# EAGLE design rgbRadioLight (EAGLE 5.09)
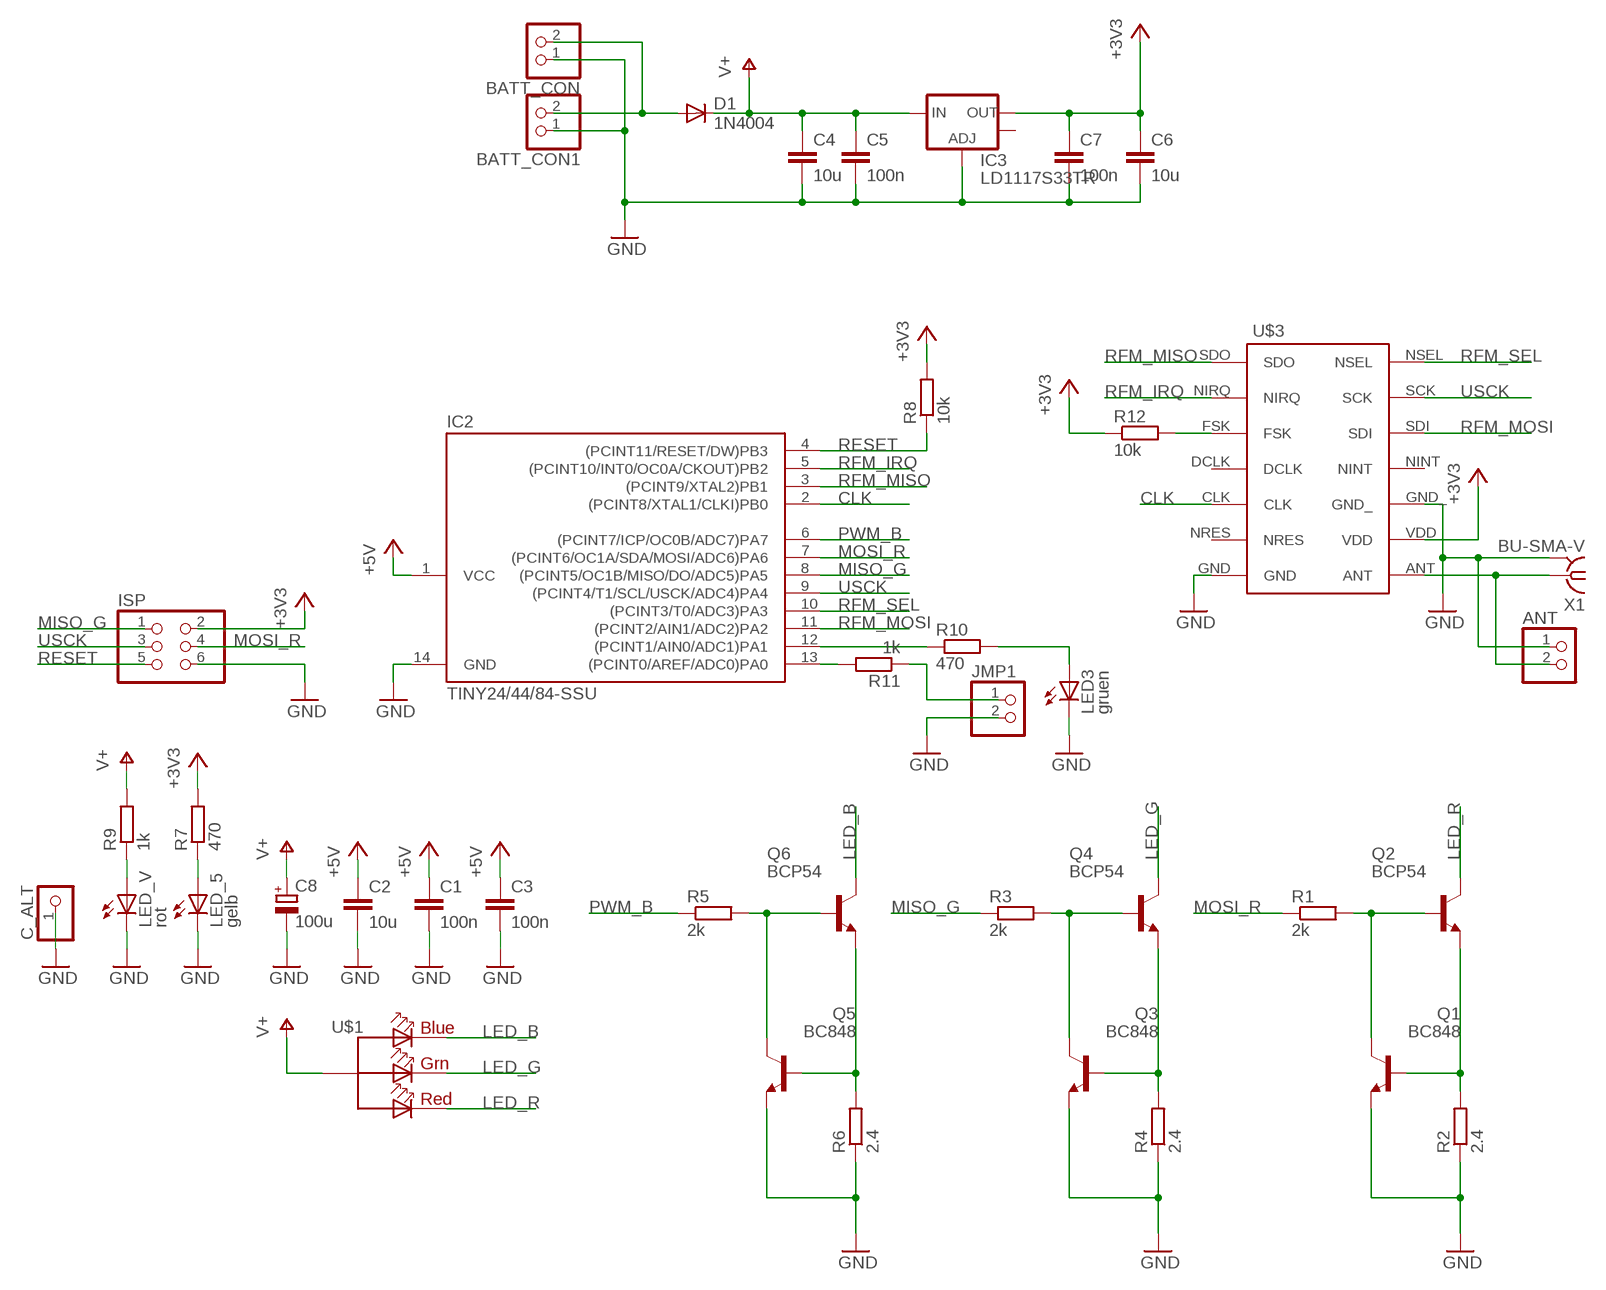
[diagram p0: schematic, sheet 1]

## Parts
ANT  PINHD-1X2  [1X02]
BATT_CON  PINHD-1X2  [1X02]
BATT_CON1  PINHD-1X2  [1X02]
C1  100n  C-EUC0805  [C0805]
C2  10u  C-EUC0805  [C0805]
C3  100n  C-EUC0805  [C0805]
C4  10u  C-EUC0805  [C0805]
C5  100n  C-EUC0805  [C0805]
C6  10u  C-EUC0805  [C0805]
C7  100n  C-EUC0805  [C0805]
C8  100u  CPOL-EUE5-8.5  [E5-8,5]
C_ALT  PINHD-1X1  [1X01]
D1  1N4004  DIODE-MELF-MLL41  [MELF-MLL41]
IC2  TINY24/44/84-SSU  [SOIC14]
IC3  LD1117S33TR  V_REG_LM1117SOT223  [SOT223]
ISP  PINHD-2X3  [2X03]
JMP1  PINHD-1X2  [1X02]
LED3  gruen  LED3MM  [LED3MM]
LED_5  gelb  LEDCHIP-LED0805  [CHIP-LED0805]
LED_V  rot  LEDCHIP-LED0805  [CHIP-LED0805]
Q1  BC848  BC848ASMD  [SOT23]
Q2  BCP54  -NPN-SOT223  [SOT223]
Q3  BC848  BC848ASMD  [SOT23]
Q4  BCP54  -NPN-SOT223  [SOT223]
Q5  BC848  BC848ASMD  [SOT23]
Q6  BCP54  -NPN-SOT223  [SOT223]
R1  2k  R-EU_R0805  [R0805]
R2  2.4  R-EU_R1206  [R1206]
R3  2k  R-EU_R0805  [R0805]
R4  2.4  R-EU_R1206  [R1206]
R5  2k  R-EU_R0805  [R0805]
R6  2.4  R-EU_R1206  [R1206]
R7  470  R-EU_R0805  [R0805]
R8  10k  R-EU_R0805  [R0805]
R9  1k  R-EU_R0805  [R0805]
R10  470  R-EU_R0805  [R0805]
R11  1k  R-EU_R0805  [R0805]
R12  10k  R-EU_R0805  [R0805]
U$1  RGB_LED_CADX_VIAS  [RGB_LED_CA_DX_VIAS]
U$3  RFM12SMD  [RFM_SMD]
X1  BU-SMA-V  [BU-SMA-V]

## Nets
+5V: C1.1 C2.1 C3.1 C6.1 C7.1 IC2.1(VCC) IC3.2(OUT) ISP.2 R7.2 R8.2 R12.1 U$3.VDD ; supply symbol labelled +3V3
BASE_B: Q5.3(C) Q6.1(B) R5.2
CLK: IC2.2((PCINT8/XTAL1/CLKI)PB0) U$3.CLK
EMITTER_B: Q5.1(B) Q6.3(E) R6.2
GND: ANT.1 BATT_CON1.1 BATT_CON.1 C1.2 C2.2 C3.2 C4.2 C5.2 C6.2 C7.2 C8.- C_ALT.1 IC2.14(GND) IC3.1(ADJ) ISP.6 JMP1.2 LED3.K(C) LED_5.C LED_V.C Q1.2(E) Q3.2(E) Q5.2(E) R2.1 R4.1 R6.1 U$3.GND U$3.GND_ X1.2(GND)
LED_B: Q6.4(C) U$1.CAT_B(BLUE)
LED_G: Q4.4(C) U$1.CAT_G(GREEN)
LED_R: Q2.4(C) U$1.CAT_R(RED)
MISO_G: IC2.8((PCINT5/OC1B/MISO/DO/ADC5)PA5) ISP.1 R3.1
MOSI_R: IC2.7((PCINT6/OC1A/SDA/MOSI/ADC6)PA6) ISP.4 R1.1
N$1: Q1.3(C) Q2.1(B) R1.2
N$2: Q1.1(B) Q2.3(E) R2.2
N$3: Q3.3(C) Q4.1(B) R3.2
N$4: Q3.1(B) Q4.3(E) R4.2
N$5: IC2.12((PCINT1/AIN0/ADC1)PA1) R10.1
N$6: BATT_CON1.2 BATT_CON.2 D1.A
N$7: LED_5.A R7.1
N$8: LED_V.A R9.1
N$9: JMP1.1 R11.1
N$10: IC2.13((PCINT0/AREF/ADC0)PA0) R11.2
N$11: LED3.A R10.2
N$12: R12.2 U$3.FSK
N$13: ANT.2 U$3.ANT X1.1
PWM_B: IC2.6((PCINT7/ICP/OC0B/ADC7)PA7) R5.1
RESET: IC2.4((PCINT11/RESET/DW)PB3) ISP.5 R8.1
RFM_IRQ: IC2.5((PCINT10/INT0/OC0A/CKOUT)PB2) U$3.NIRQ
RFM_MISO: IC2.3((PCINT9/XTAL2)PB1) U$3.SDO
RFM_MOSI: IC2.11((PCINT2/AIN1/ADC2)PA2) U$3.SDI
RFM_SEL: IC2.10((PCINT3/T0/ADC3)PA3) U$3.NSEL
USCK: IC2.9((PCINT4/T1/SCL/USCK/ADC4)PA4) ISP.3 U$3.SCK
V+: C4.1 C5.1 C8.+ D1.C IC3.3(IN) R9.2 U$1.CA(VCC)
Unconnected: IC3.4(OUT) U$3.DCLK U$3.NINT U$3.NRES

## Power pins joined to a net without a drawn wire
GND: X1.3(GND) X1.4(GND) X1.5(GND)

## Library data of the parts
ANT BATT_CON BATT_CON1 JMP1 = pinhead:PINHD-1X2: PIN HEADER
C1-C7 = rcl:C-EU: CAPACITOR, European symbol
C8 = rcl:CPOL-EU: POLARIZED CAPACITOR, European symbol
C_ALT = pinhead:PINHD-1X1: PIN HEADER
D1 = diode:DIODE-: DIODE
IC2 = avr-6:TINY24/44/84
IC3 = SparkFun:V_REG_LM1117: Voltage Regulator LM1117 Standard adjustable voltage regulator but in SMD form. Spark Fun Electronics SKU : COM-00595
ISP = pinhead:PINHD-2X3: PIN HEADER
LED3 LED_5 LED_V = led:LED: LED OSRAM: - CHIPLED LG R971, LG N971, LY N971, LG Q971, LY Q971, LO R971, LY R971 LH N974, LH R974 LS Q976, LO Q976, LY Q976 LO Q996 - Hyper CHIPLED LW Q18S LB Q993, LB Q99A, LB R99A - SideLED LS A670, LO A670, LY A670, LG A670, LP A670 LB A673, LV A673, LT A673, LW A673 LH A674 LY A675 LS A676, LA A676, LO A676, LY A676, LW A676 LS A679, LY A679, LG A679 - Hyper Micro SIDELED® LS Y876, LA Y876, LO Y876, LY Y876 LT Y87S - SmartLED LW L88C, LW L88S LB L89C, LB L89S, LG L890 LS L89K, LO L89K, LY L89K LS L896, LA L896, LO L896, LY L896 - TOPLED LS T670, LO T670, LY T670, LG T670, LP T670 LSG T670, LSP T670, LSY T670, LOP T670, LYG T670 LG T671, LOG T671, LSG T671 LB T673, LV T673, LT T673, LW T673 LH T674 LS T676, LA T676, LO T676, LY T676, LB T676, LH T676, LSB T676, LW T676 LB T67C, LV T67C, LT T67C, LS T67K, LO T67K, LY T67K, LW E67C LS E67B, LA E67B, LO E67B, LY E67B, LB E67C, LV E67C, LT E67C LW T67C LS T679, LY T679, LG T679 LS T770, LO T770, LY T770, LG T770, LP T770 LB T773, LV T773, LT T773, LW T773 LH T774 LS E675, LA E675, LY E675, LS T675 LS T776, LA T776, LO T776, LY T776, LB T776 LHGB T686 LT T68C, LB T68C - Hyper Mini TOPLED® LB M676 - Mini TOPLED Santana® LG M470 LS M47K, LO M47K, LY M47K Source: http://www.osram.convergy.de LUXEON: - LUMILED® LXK2-PW12-R00, LXK2-PW12-S00, LXK2-PW14-U00, LXK2-PW14-V00 LXK2-PM12-R00, LXK2-PM12-S00, LXK2-PM14-U00 LXK2-PE12-Q00, LXK2-PE12-R00, LXK2-PE12-S00, LXK2-PE14-T00, LXK2-PE14-U00 LXK2-PB12-K00, LXK2-PB12-L00, LXK2-PB12-M00, LXK2-PB14-N00, LXK2-PB14-P00, LXK2-PB14-Q00 LXK2-PR12-L00, LXK2-PR12-M00, LXK2-PR14-Q00, LXK2-PR14-R00 LXK2-PD12-Q00, LXK2-PD12-R00, LXK2-PD12-S00 LXK2-PH12-R00, LXK2-PH12-S00 LXK2-PL12-P00, LXK2-PL12-Q00, LXK2-PL12-R00 Source: www.luxeon.com KINGBRIGHT: KA-3528ASYC Source: www.kingbright.com
Q1 Q3 Q5 = transistor-npn:BC848*: NPN Transistor
Q2 Q4 Q6 = transistor-neu-to92:*-NPN-: NPN Transistror
R1-R12 = rcl:R-EU_: RESISTOR, European symbol
U$1 = ppeter:RGB_LED_CA
U$3 = ppeter:RFM12: RFM12 Funk Modul
X1 = con-coax:BU-SMA-V: FEMALE SMA CONNECTOR Radiall distributor RS 112-3794

## Board
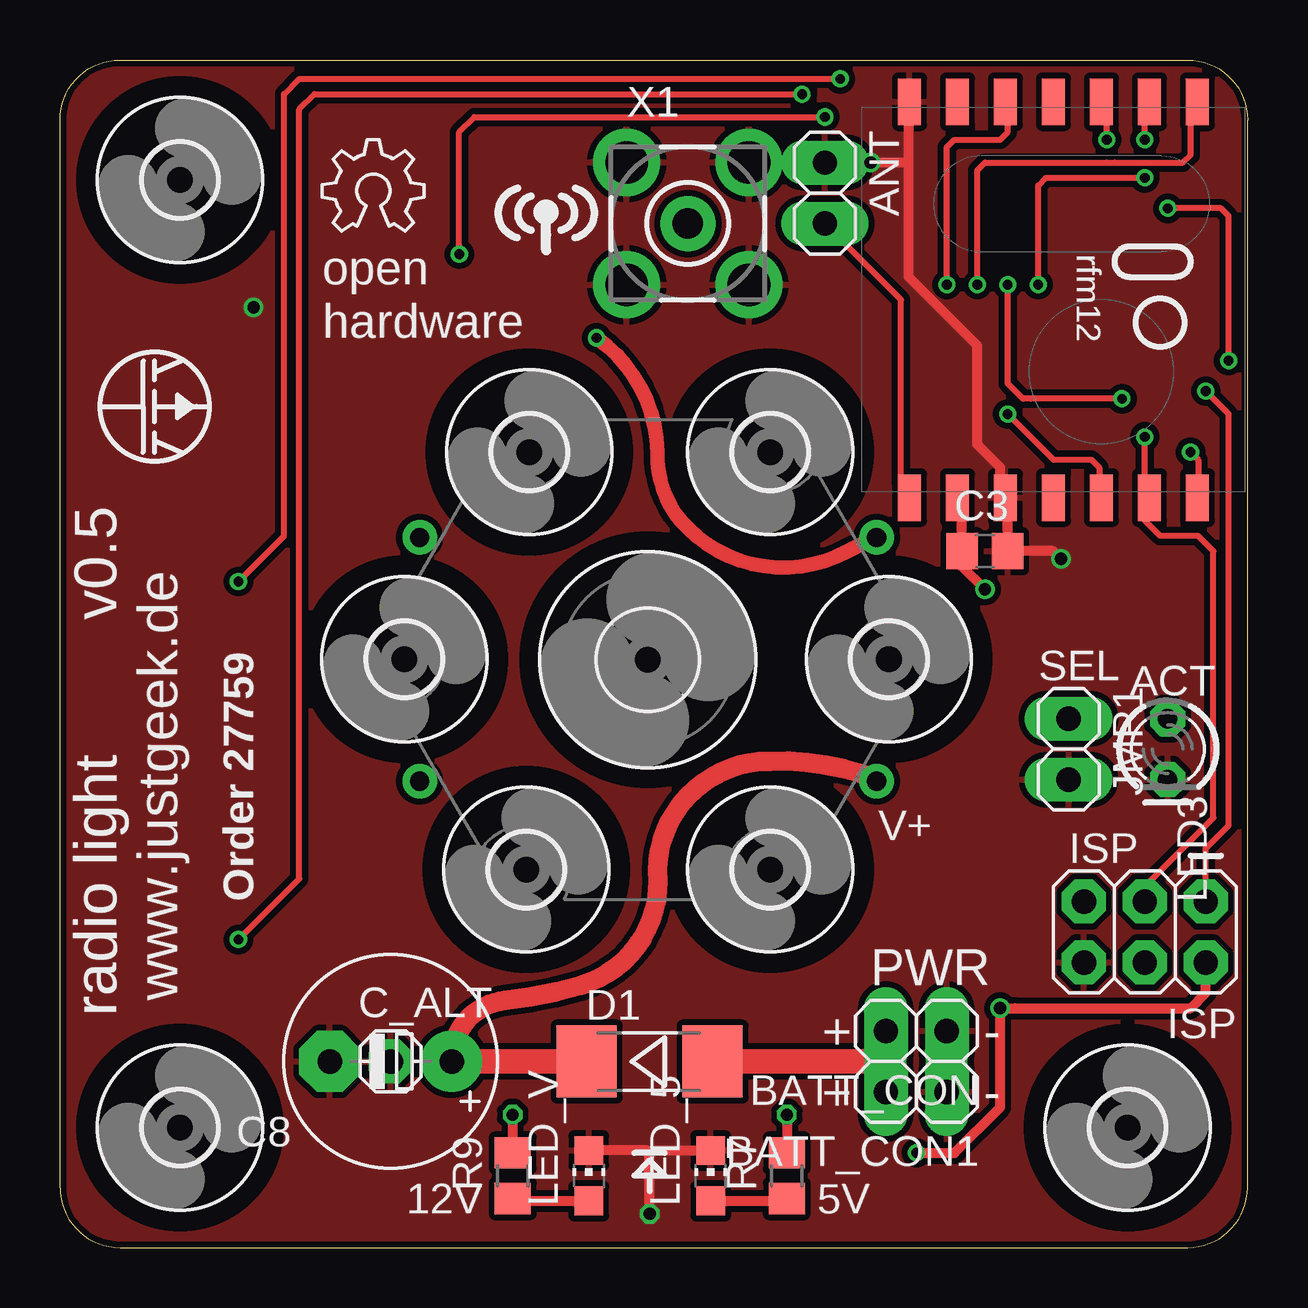
[diagram p1: board, top side]
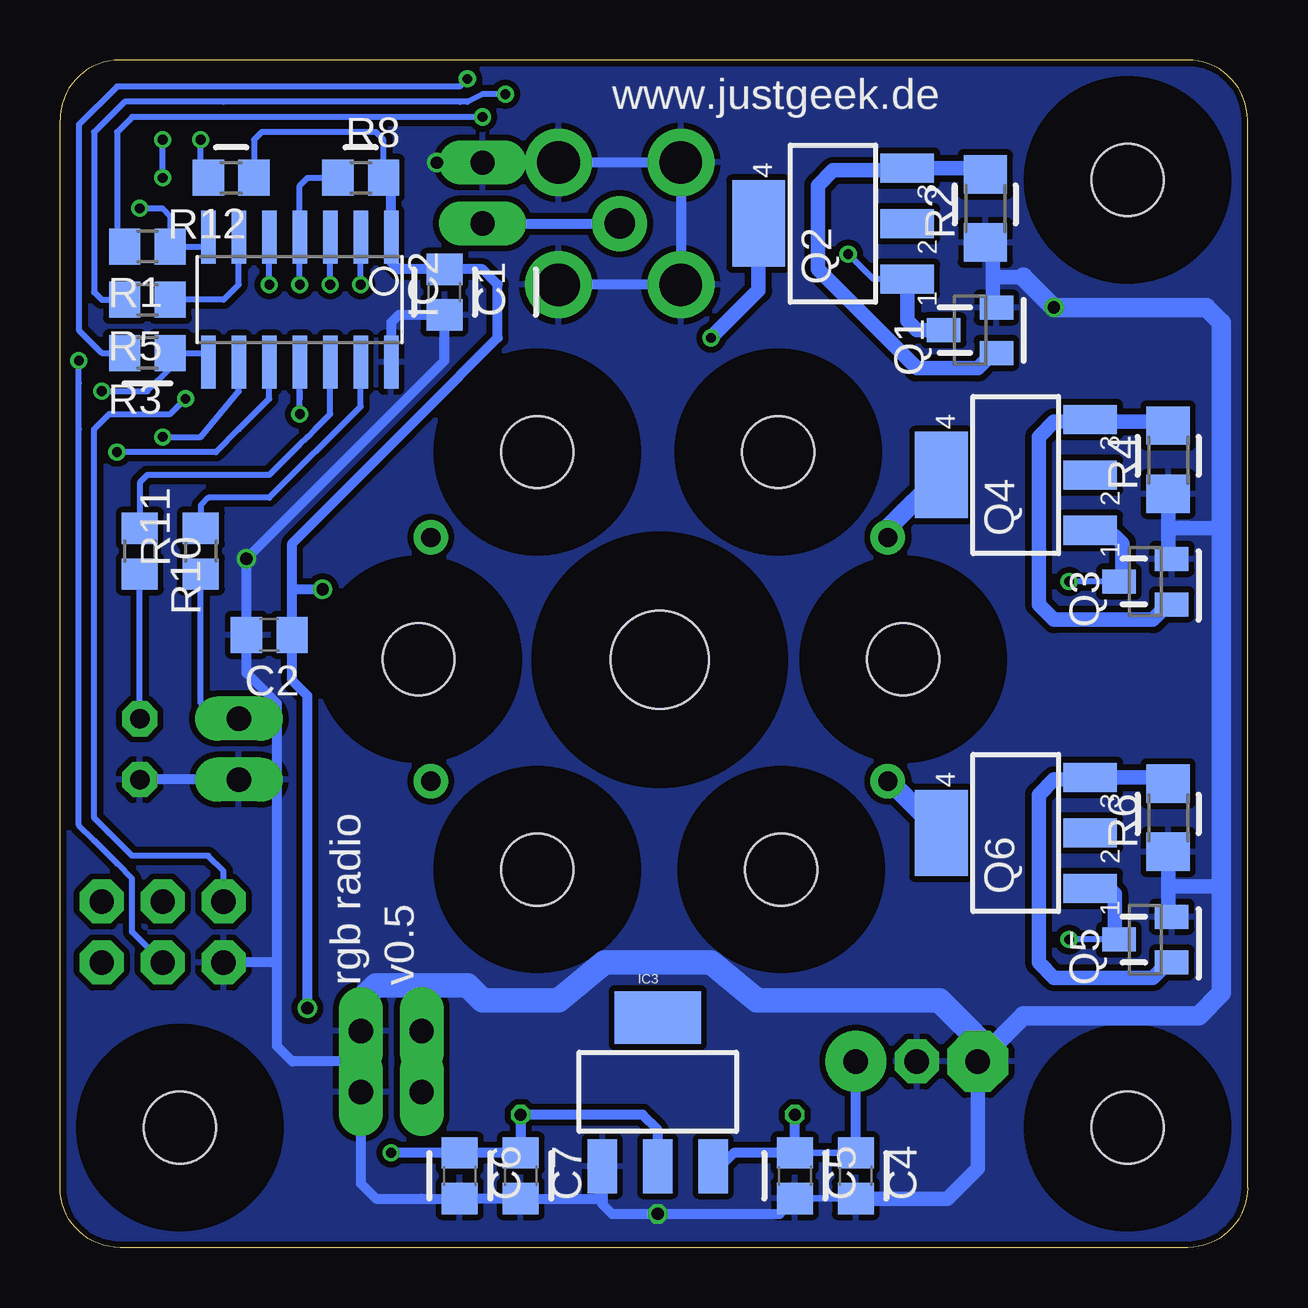
[diagram p2: board, bottom side, seen from below]

Size 49.5 x 49.5 mm. Coordinates in mm from the lower left corner, seen from the top.
Outline: 0,2.5 arc90 2.5,0 47,0 arc90 49.5,2.5 49.5,47 arc90 47,49.5 2.5,49.5 arc90 0,47 0,2.5
Copper layers (1*16): Top 0.035mm / dielectric 1.5mm / Bottom 0.035mm
Design rules "Fusion_eagle_rule_v1.1 *": minimum track width 6mil, minimum drill 12mil, track to track 6mil, track to pad 6mil, pad to pad 6mil, via to via 6mil, smd to smd 0mil, copper to edge 10mil, drill to drill 10mil, minimum pad ring 10mil, minimum via ring 6mil, stop-mask expansion 2mil, vias tented up to drill 100mil, thermal gap 10mil

### Footprints (pad centres in the part's own frame; a part is rotated, then mirrored left to right if it is on the bottom)
1X02 = drill 1.016 long: 1 -1.27,0; 2 1.27,0
C0805 = smd 1.3 x 1.5: 1 -0.95,0; 2 0.95,0
E5-8,5 = drill 1.016 pad 2.54 round: + -2.54,0 | drill 1.016 pad 2.54 octagon: - 2.54,0
1X01 = drill 1.016 octagon: 1 0,0
MELF-MLL41 = smd 2.5 x 3: A 2.625,0; C -2.625,0
SOIC14 = smd 0.61 x 2.21: 1 -3.81,-2.603; 2 -2.54,-2.603; 3 -1.27,-2.603; 4 0,-2.603; 5 1.27,-2.603; 6 2.54,-2.603; 7 3.81,-2.603; 8 3.81,2.603; 9 2.54,2.603; 10 1.27,2.603; 11 0,2.603; 12 -1.27,2.603; 13 -2.54,2.603; 14 -3.81,2.603
SOT223 = smd 1.219 x 2.235: 1 -2.311,-3.099; 2 0,-3.099; 3 2.311,-3.099 | smd 3.6 x 2.2: 4 0,3.099
2X03 = drill 1.016 octagon: 1 -2.54,-1.27; 2 -2.54,1.27; 3 0,-1.27; 4 0,1.27; 5 2.54,-1.27; 6 2.54,1.27
LED3MM = drill 0.813 octagon: A -1.27,0; K 1.27,0
CHIP-LED0805 = smd 1.2 x 1.2: A 0,-1.05; C 0,1.05
SOT23 = smd 1 x 1.4: 1 -0.95,-1.1; 2 0.95,-1.1; 3 0,1.1
R0805 = smd 1.3 x 1.5: 1 -0.95,0; 2 0.95,0
R1206 = smd 1.6 x 1.803: 1 -1.422,0; 2 1.422,0
RGB_LED_CA_DX_VIAS = drill 0.8 round: CA 9.525,-5.08; CAT_B -9.525,-5.08; CAT_G -9.525,5.08; CAT_R 9.525,5.08
4,1 = hole 4.1: 0,0
RFM_SMD = smd 1.93 x 0.965: ANT 8.25,-6; CLK -8.25,-2; DCLK -8.25,0; FSK -8.25,2; GND -8.25,-6; GND_ 8.25,-2; NINT 8.25,0; NIRQ -8.25,4; NRES -8.25,-4; NSEL 8.25,6; SCK 8.25,4; SDI 8.25,2; SDO -8.25,6; VDD 8.25,-4
3,0 = hole 3: 0,0
BU-SMA-V = drill 1.27 round: 1 0,0 | drill 1.778 round: 2 -2.55,2.55; 3 2.55,2.55; 4 2.55,-2.55; 5 -2.55,-2.55

### Placement (x,y rotation side)
ANT  31.89,43.95 270 top
BATT_CON  35.7,9.03 180 top
BATT_CON1  35.7,6.49 180 top
C1  33.47,39.82 270 bottom
C2  40.78,25.54 180 bottom
C3  38.55,29.03 0 top
C4  16.33,2.99 270 bottom
C5  18.87,2.99 270 bottom
C6  32.84,2.99 270 bottom
C7  30.3,2.99 270 bottom
C8  13.79,7.75 180 top
C_ALT  13.79,7.75 0 top
D1  24.58,7.75 0 top
IC2  39.51,39.51 180 bottom
IC3  24.58,6.49 0 bottom
ISP  45.22,13.15 180 top
JMP1  42.05,20.77 270 top
LED3  46.17,20.77 270 top
LED_5  27.12,2.99 0 top
LED_V  22.04,2.99 0 top
Q1  11.57,38.23 90 bottom
Q2  17.28,42.68 90 bottom
Q3  4.26,27.76 90 bottom
Q4  9.66,32.2 90 bottom
Q5  4.26,12.84 90 bottom
Q6  9.66,17.28 90 bottom
R1  45.86,41.73 180 bottom
R2  10.93,43.32 90 bottom
R3  45.86,37.28 180 bottom
R4  3.31,32.84 90 bottom
R5  45.86,39.51 180 bottom
R6  3.31,17.91 90 bottom
R7  30.3,2.99 90 top
R8  36.97,44.59 0 bottom
R9  18.87,2.99 90 top
R10  46.17,29.03 270 bottom
R11  43.63,29.03 90 bottom
R12  42.36,44.59 180 bottom
U$1  24.52,24.52 0 top
U$2  [4,1]  24.5,24.5 0 top
U$3  41.41,39.51 270 top
U$4  [3,0]  19.44,15.76 0 top
U$5  [3,0]  29.6,15.76 0 top
U$6  [3,0]  14.36,24.52 0 top
U$7  [3,0]  19.57,33.16 0 top
U$8  [3,0]  5,5 0 top
U$9  [3,0]  29.6,33.16 0 top
U$10  [3,0]  34.55,24.52 0 top
U$13  [3,0]  5,44.5 0 top
U$14  [3,0]  44.5,5 0 top
U$15  [JUSTGEEK_LOGO_XS]  3.95,35.06 90 top
U$16  [OSHW_6X150_NOTEXT]  10.93,42.36 0 top
X1  26.17,42.68 0 top

### Tracks (layer width: path | path; a pad name or v marks a point on that pad's centre or on a via)
+5V  (via drill 0.41, 0.51)
  Top 0.406: v35.69,3.95 37.28,3.95 39.19,5.85 v39.19,9.98 39.82,9.98 47.12,9.98 47.76,10.61 ISP.2 | v30.3,5.53 C7.1 | U$3.VDD 37.6,31.06 37.6,29.34 C3.1 37.6,28.39 v38.55,27.44
  Bottom 0.254: 35.69,41.09 IC2.1 | 35.69,44.26 R8.2 | R12.1 41.41,46.17 41.09,46.49 36.33,46.49 36.01,46.17 R8.2 | R8.2 36.01,44.27
  Bottom 0.279: C7.1 29.98,4.26
  Bottom 0.406: C7.1 C6.1 v35.69,3.94 v35.69,3.95 | 35.69,41.09 35.37,40.77 C1.1 31.89,40.78 31.25,40.14 31.25,37.92 34.43,34.74 37.28,31.89 37.6,31.57 39.51,29.66 39.82,29.34 39.82,27.44 | IC2.1 35.69,44.26 | C7.1 29.98,3.95 | IC3.2 24.58,4.9 25.22,5.53 v30.3,5.53 30.3,5.21 C7.1 | 39.82,25.22 39.82,27.44 | 39.82,25.22 C2.1 | 39.82,25.22 39.82,23.63 39.19,22.99 39.19,10.29 v39.19,9.98 | 39.82,27.44 v38.55,27.44
BASE_B  (via drill 0.41)
  Top 0.254: v30.93,48.08 10.61,48.08 9.98,47.44 9.98,15.37 v7.44,12.84
  Bottom 0.254: R5.2 47.76,39.51 48.08,39.82 48.08,46.49 46.81,47.76 42.68,47.76 32.84,47.76 32.52,47.76 31.89,48.08 v30.93,48.08 | Q5.3 v7.44,12.84
  Bottom 0.61: Q6.1 5.76,14.97 5.53,14.74 5.53,13.01 Q5.3
CLK  (via drill 0.41)
  Top 0.254: U$3.CLK 39.43,48.01 39.51,48.08 39.51,46.49 39.19,46.17 37.28,46.17 36.97,45.86 v36.97,40.14
  Bottom 0.254: v36.97,40.14 36.97,40.46 IC2.2
EMITTER_B
  Bottom 0.406: 3.56,19.59 R6.2
  Bottom 0.61: 3.56,19.59 Q6.3 6.65,19.5 8.07,19.5 8.71,18.87 8.71,11.88 8.07,11.25 3.95,11.25 3.31,11.89 Q5.1
GND  (via drill 0.51)
  Top 0.254: 39.51,30.91 U$3.GND_ 39.48,30.93 39.51,30.93 | 35.41,47.47 U$3.GND | LED_V.C 22.04,4.26
  Top 0.406: 39.19,31.23 39.19,31.25 39.19,32.52 38.23,33.47 38.23,37.6 37.6,38.23 36.97,38.87 35.38,40.46 35.38,44.58 35.38,45.22 | 39.19,31.23 U$3.GND_ 39.51,31.25 C3.2 | 35.38,45.22 35.38,47.76 35.41,47.73 35.41,47.47 | 39.19,30.61 39.19,30.93 39.19,31.23 | v24.58,1.4 24.58,3.95 | LED_5.C 24.68,4.04 24.58,3.95 | LED_V.C 24.49,4.04 24.58,3.95 | 35.38,45.22 v33.79,45.22 | C3.2 41.41,29.03 v41.73,28.71 | C3.2
  Bottom 0.279: 19.19,1.72 C5.2 C4.2 | C7.2 29.98,1.72
  Bottom 0.406: 3.31,29.03 Q3.2 | 3.31,16.01 R6.1 | 3.31,14.27 Q5.2 | BATT_CON1.1 36.97,2.67 36.33,2.04 34.43,2.04 C6.2 C7.2 | 40.46,11.88 ISP.6 | LED3.K JMP1.2 40.46,19.5 | IC2.14 35.69,38.55 35.38,38.87 C1.2 33.47,36.97 35.38,35.06 38.87,31.57 39.82,30.61 40.46,29.98 v41.72,28.71 | C5.2 18.96,1.95 | C7.2 | C7.2 30.21,1.95 | C7.2 27.12,2.04 26.89,2.59 IC3.1 26.89,1.81 26.49,1.4 v24.58,1.4 19.5,1.4 C5.2 | C7.2 | 40.46,11.88 40.46,19.5 | BATT_CON.1 36.97,7.76 39.82,7.76 40.46,8.39 40.46,11.88 | v33.79,45.22 ANT.1 31.88,45.23 X1.3 X1.2 X1.5 X1.4 | 40.46,19.5 40.46,22.68 41.72,23.95 C2.2 v41.72,28.71 | 41.73,28.39 v41.73,28.71 v41.72,28.71
  Bottom 0.61: 3.31,29.98 3.31,29.03 | 3.31,29.98 R4.1 | 3.31,15.06 3.31,14.27 | 3.31,15.06 3.31,16.01 | 10.47,41.43 R2.1 10.61,41.58 10.61,40.46 | 1.09,29.98 3.31,29.98 | 1.09,15.06 3.31,15.06 | 10.61,39.51 10.61,39.19 10.61,39.18 Q1.2 10.47,39.36 10.61,39.51 | 10.61,40.46 10.61,39.51 | 10.61,40.46 10.61,39.51 | C8.- 11.25,3.31 12.52,2.04 C4.2 | 9.34,40.46 10.61,40.46
  Bottom 0.813: C8.- 9.34,9.66 2.04,9.66 1.09,10.61 1.09,15.06 1.09,15.37 1.09,29.98 1.09,38.55 1.72,39.19 v8.07,39.19 9.34,40.46
  Bottom 1.016: C8.- 11.25,8.71 12.84,10.29 20.45,10.29 22.36,11.88 26.81,11.88 28.71,10.29 31.89,10.29 32.52,10.93 36.33,10.93 36.97,10.29 BATT_CON.1
  Bottom 1.219: BATT_CON.1 BATT_CON1.1
  pour Bottom (isolate 0.254): 0,0 49.98,-0.64 49.66,49.66 0,49.66
  pour Top (isolate 0.254): 0,-0.32 0,49.66 49.66,49.66 49.98,-0.32
LED_B
  Bottom 0.61: Q6.4 13.47,17.28
  Bottom 0.813: U$1.CAT_B 14.92,19.44 Q6.4
LED_G
  Bottom 0.813: Q4.4 14.98,29.98 14.98,29.66 14.98,29.61 U$1.CAT_G
LED_R  (via drill 0.41)
  Top 0.406: 34.11,29.66 U$1.CAT_R
  Top 0.61: 34.11,29.66 32.84,29.03 arc-73 26.17,29.98 arc-47 24.9,33.15 arc54 v22.36,37.92
  Bottom 0.61: v22.36,37.92 22.28,37.92 v22.36,37.92 | v22.36,37.92 20.38,39.9 Q2.4
MISO_G  (via drill 0.41)
  Top 0.254: ISP.1 47.76,16.65 48.71,17.6 48.71,34.74 v47.76,35.69
  Bottom 0.254: IC2.8 43.32,37.28 R3.1 44.9,36.65 45.86,35.69 v47.76,35.69
MOSI_R  (via drill 0.41)
  Top 0.254: v46.17,43.32 48.4,43.32 48.71,43 v48.71,36.97
  Bottom 0.254: IC2.7 43.32,41.73 R1.1 | R1.1 | v46.17,43.32 45.22,43.32 44.9,43 44.9,42.04 R1.1 | v48.71,36.97 48.71,36.01 48.71,34.11 48.71,17.6 48.08,16.96 47.12,16.01 46.49,15.37 46.49,13.15 ISP.4
N$1  (via drill 0.41)
  Top 0.254: v16.65,41.41 16.65,46.49 17.28,47.12 31.57,47.12 v31.89,47.12
  Bottom 0.254: R1.2 | R1.2 47.12,41.73 47.12,46.49 46.49,47.12 33.47,47.12 33.15,47.12 32.84,47.12 v31.89,47.12 | Q2.1 15.6,40.37 v16.65,41.41
  Bottom 0.61: Q2.1 14.18,38.63 13.79,38.23 Q1.3
N$2
  Bottom 0.61: R2.2 11.18,44.99 Q2.3 14.27,44.9 17.28,44.9 17.92,44.27 17.92,40.78 13.79,36.65 11.25,36.65 10.61,37.29 Q1.1
N$3  (via drill 0.41)
  Top 0.254: v32.52,48.71 9.98,48.71 9.34,48.08 9.34,29.66 v7.44,27.76
  Bottom 0.254: R3.2 47.76,37.28 48.71,38.23 48.71,46.81 47.12,48.4 42.68,48.4 42.36,48.4 32.84,48.4 v32.52,48.71 | 5.85,27.76 v7.44,27.76
  Bottom 0.406: 5.85,29.66 6.49,29.66 6.56,29.74 Q4.1 | Q3.3 5.85,27.76
  Bottom 0.61: Q4.1 6.49,29.81 | 5.85,29.66 5.53,29.66 5.21,29.34 5.21,27.9 Q3.3
N$4
  Bottom 0.406: Q4.3 6.49,34.43 | 3.95,34.43 R4.2
  Bottom 0.61: 6.49,34.43 3.95,34.43 | Q3.1 3.31,26.81 3.95,26.17 8.07,26.17 8.71,26.81 8.71,33.79 8.07,34.43 6.65,34.43 Q4.3
N$5
  Bottom 0.254: IC2.12 38.23,34.74 38.87,34.11 39.19,33.79 39.51,33.47 39.5,33.47 40.77,32.2 45.86,32.2 46.17,31.89 R10.1
N$6
  Top 1.016: D1.A 34.43,7.76 | 34.43,7.76 BATT_CON.2 | 34.43,7.76 BATT_CON1.2
N$7
  Top 0.406: LED_5.A 30.2,1.94 R7.1
N$8
  Top 0.406: LED_V.A 18.97,1.94 R9.1
N$9
  Bottom 0.254: R11.1 43.63,22.68 43,22.04 JMP1.1
N$10
  Bottom 0.254: IC2.13 36.97,35.06 40.78,31.25 43.32,31.25 43.63,30.93 R11.2
N$11
  Bottom 0.254: LED3.A R10.2
N$12  (via drill 0.41)
  Top 0.254: v43.63,46.17 43.63,47.78 U$3.FSK
  Bottom 0.254: R12.2 43.31,44.9 43.63,45.22 v43.63,46.17
N$13
  Top 0.254: U$3.ANT 35.41,31.54 35.06,31.89 35.06,39.51 33.15,41.41 ANT.2
  Bottom 0.406: ANT.2 X1.1
PWM_B
  Bottom 0.254: IC2.6 42.04,40.14 42.68,39.51 R5.1
RESET  (via drill 0.41)
  Top 0.254: v39.51,40.14 39.51,39.51 39.51,36.01 40.14,35.38 40.46,35.38 v44.27,35.38
  Bottom 0.254: R8.1 39.19,44.58 39.51,44.27 IC2.4 v39.51,40.14 | ISP.5 42.68,15.69 43.32,16.33 46.49,16.33 48.08,17.92 48.08,29.03 48.08,29.34 48.08,34.11 47.44,34.74 45.86,34.74 44.9,34.74 v44.27,35.38
RFM_IRQ  (via drill 0.41)
  Top 0.254: v40.78,40.14 40.78,44.27 41.09,44.58 43.95,44.58 44.58,44.58 v45.22,44.58 | v45.22,46.17 45.22,47.82 U$3.NIRQ
  Bottom 0.254: v40.78,40.14 IC2.5 | v45.22,44.58 v45.22,46.17
RFM_MISO  (via drill 0.41)
  Top 0.254: v38.23,40.14 38.23,40.78 38.23,41.09 38.23,44.9 38.55,45.22 43.63,45.22 43.95,45.22 46.81,45.22 47.12,45.54 47.12,47.72 U$3.SDO
  Bottom 0.254: IC2.3 38.23,40.46 v38.23,40.14
RFM_MOSI  (via drill 0.41)
  Top 0.254: U$3.SDI 43.32,31.1 43.32,32.52 43,32.84 41.41,32.84 v39.51,34.74
  Bottom 0.254: 39.51,35.69 IC2.11 | 39.51,35.69 39.51,35.38 | v39.51,34.74 39.51,35.69
RFM_SEL  (via drill 0.41)
  Top 0.254: U$3.NSEL 47.41,30.97 47.44,30.93 47.44,32.84 v47.12,33.15
  Bottom 0.254: v47.12,33.15 43,33.15 42.04,34.11 40.78,35.38 IC2.10
USCK  (via drill 0.41)
  Top 0.254: v45.22,33.79 45.22,30.93 45.54,30.93 45.47,31.01 U$3.SCK 45.22,30.81 45.22,30.3 45.86,29.66 47.44,29.66 48.08,29.03 48.08,17.92 46.49,16.33 45.22,15.06 ISP.3
  Bottom 0.254: v45.22,33.79 43.63,33.79 42.04,35.69 IC2.9
V+  (via drill 0.51)
  Top 0.406: v18.87,5.53 C5.1 | 34.11,19.5 U$1.CA
  Top 0.813: 34.11,19.5 arc24 29.6,20.26 arc90 24.9,15.69 arc-79 21.72,10.93 arc-11 18.55,10.29 arc86 C8.+
  Top 1.016: C8.+ D1.C
  Bottom 0.279: C4.1 C5.1
  Bottom 0.406: C4.1 C8.+ | IC3.3 22.27,3.08 21.41,3.95 C5.1 v18.87,5.53

### Text on the board
tPlace: rfm12 | rfm12 | open | hardware | v0.5 | SEL | ACT | V+ | ISP | Order 27759 | PWR | radio light | radio light | www.justgeek.de | + | - | + | - | 12V | 5V
bPlace: www.justgeek.de | v0.5 | rgb radio